# Altium schematic sheet 2020-09-19_14-30-221.schdoc
size 303 x 130 mm; SheetNumber: 1; SheetTotal: 1
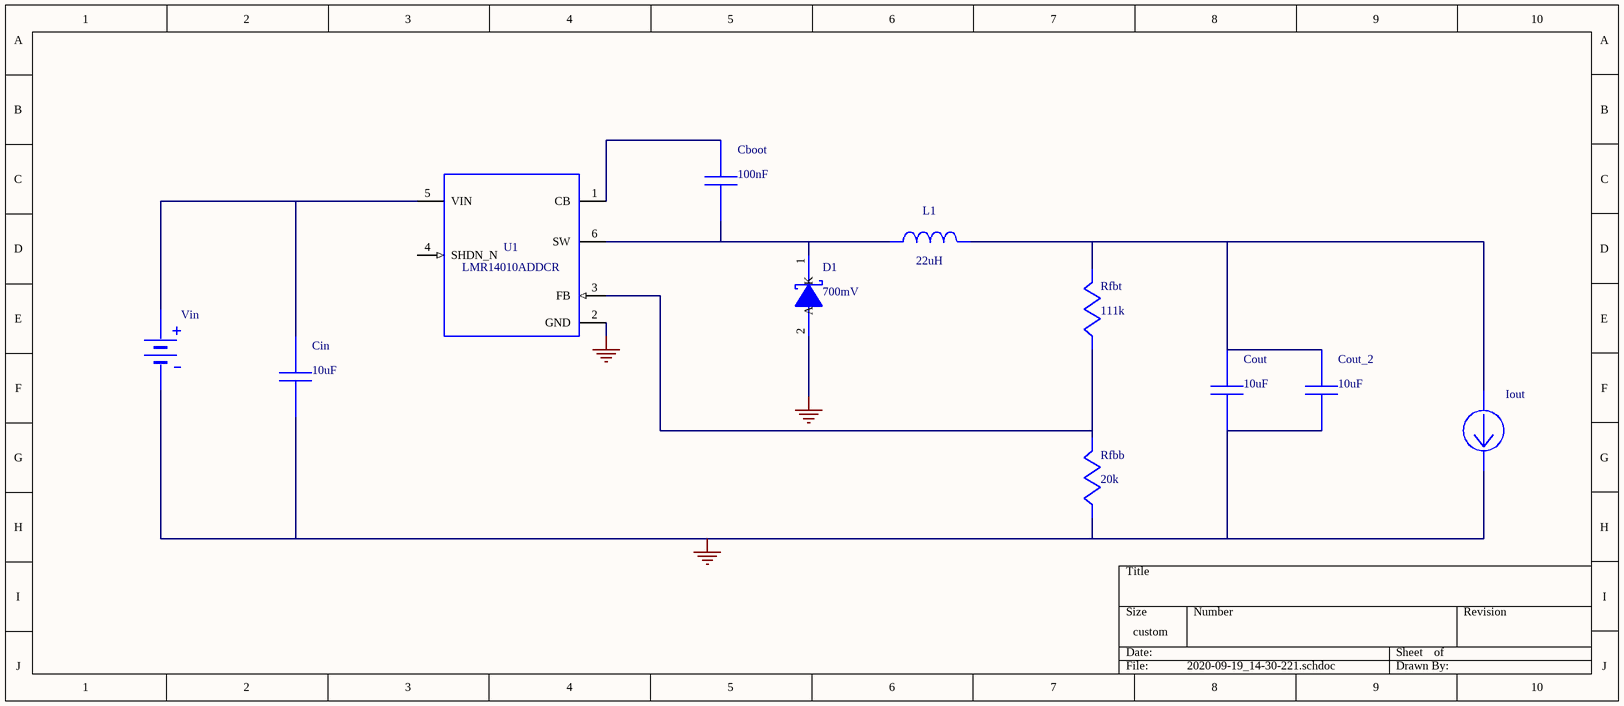
[diagram p0: 2020-09-19_14-30-221.schdoc]

## Parts
Cboot  value 100nF  (hidden comment: C0805C104M5RACTU)
Cin  value 10uF  (hidden comment: C3225X7R1H106M250AC)
Cout  value 10uF  (hidden comment: C3216X6S1V106K160AC)
Cout_2  value 10uF  (hidden comment: C3216X6S1V106K160AC)
D1  value 700mV  (hidden comment: SS26FL)
Iout  WB_CURRENT_LOAD  (value not drawn)
L1  value 22uH  (hidden comment: NPI105C220MTRF)
Rfbb  value 20k  (hidden comment: CRCW040220K0FKED)
Rfbt  value 111k  (hidden comment: RT0805BRD07111KL)
U1  LMR14010ADDCR
Vin  WB_BATTERY  (value not drawn)

## Nets
0: Cin.2 Cout.2 Cout_2.2 D1.2(A) Iout.2(-) Rfbb.2 U1.2(GND) Vin.2(-)
NetCboot_1: Cboot.1 U1.1(CB)
NetCboot_2: Cboot.2 D1.1(K) L1.1 U1.6(SW)
NetCin_1: Cin.1 U1.5(VIN) Vin.1(+)
NetCout_1: Cout.1 Cout_2.1 Iout.1(+) L1.2 Rfbt.1
NetRfbb_1: Rfbb.1 Rfbt.2 U1.3(FB)

Not connected (* = marked no-connect by the designer): U1 4(SHDN_N)

## Library data of the parts
Cboot = C0805C104M5RACTU: Manufacturer Name: Kemet; PackageReference: C0805C104M5RACTU; Manufacturer Part Number: C0805C104M5RACTU
Cin = C3225X7R1H106M250AC: C3225X7R1H106M25; Manufacturer Name: TDK; PackageReference: C3225X7R1H106M250AC; Manufacturer Part Number: C3225X7R1H106M250AC
Cout Cout_2 = C3216X6S1V106K160AC: C3216X6S1V106K16; Manufacturer Name: TDK; PackageReference: C3216X6S1V106K160AC; Manufacturer Part Number: C3216X6S1V106K160AC
D1 = SS26FL: Manufacturer Name: Fairchild Semiconductor; PackageReference: SS26FL; Manufacturer Part Number: SS26FL
L1 = NPI105C220MTRF: Manufacturer Name: NIC Components; PackageReference: NPI105C220MTRF; Manufacturer Part Number: NPI105C220MTRF
Rfbb = CRCW040220K0FKED: Manufacturer Name: Vishay-Dale; PackageReference: CRCW040220K0FKED; Manufacturer Part Number: CRCW040220K0FKED
Rfbt = RT0805BRD07111KL: Manufacturer Name: Yageo; PackageReference: RT0805BRD07111KL; Manufacturer Part Number: RT0805BRD07111KL
U1 = LMR14010ADDCR: Manufacturer Name: Texas Instruments; PackageReference: LMR14010ADDCR; Manufacturer Part Number: LMR14010ADDCR; Value: N/A
Iout = WB_CURRENT_LOAD: PackageReference: WB_CURRENT_LOAD; Manufacturer Part Number: WB_CURRENT_LOAD; Manufacturer Name: WB_CURRENT_LOAD; Value: N/A
Vin = WB_BATTERY: PackageReference: WB_BATTERY; Manufacturer Part Number: WB_BATTERY; Manufacturer Name: WB_BATTERY; Value: N/A